# EAGLE design nhb12 (EAGLE 5.08)
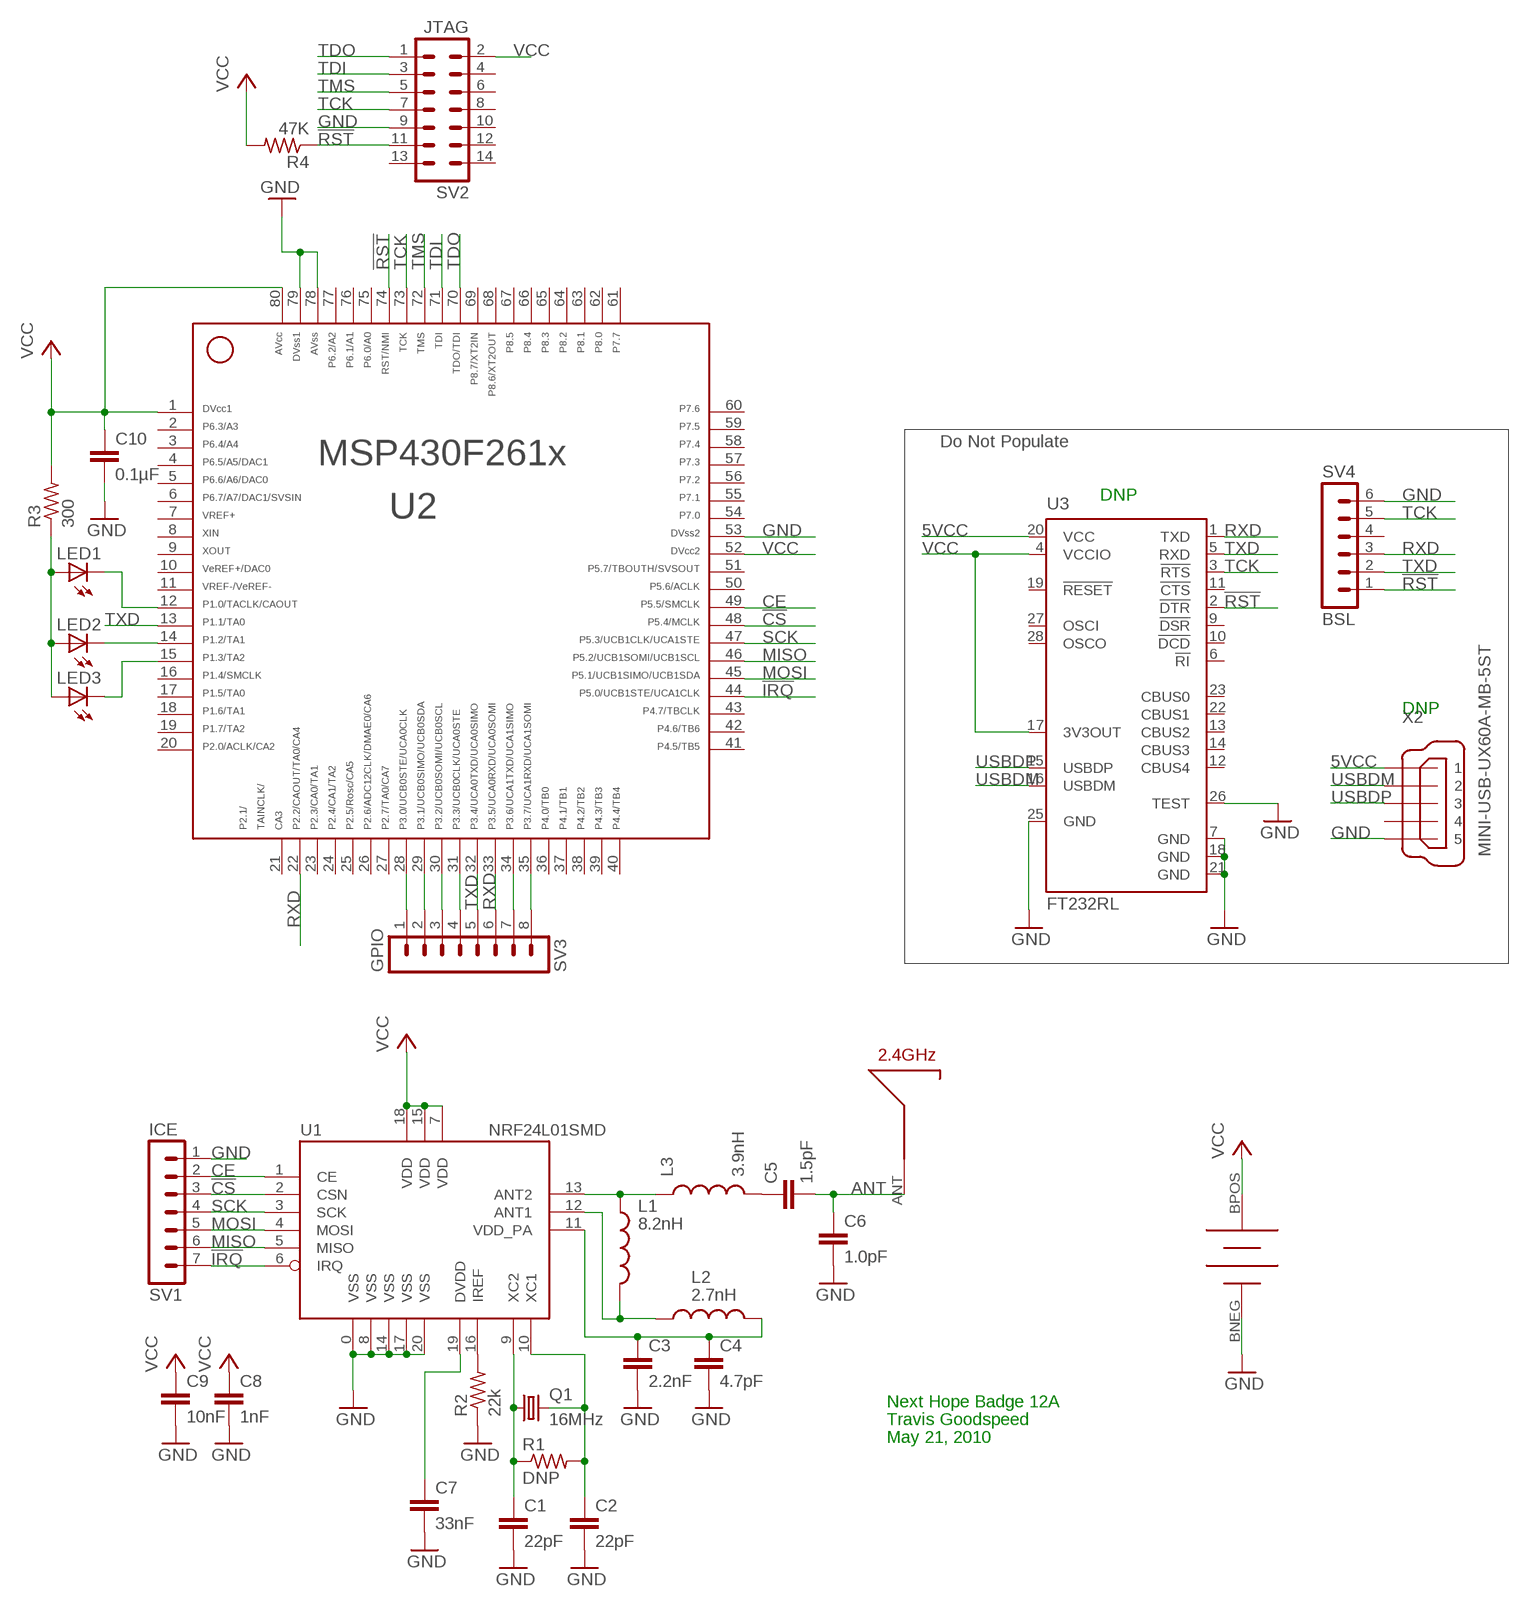
[diagram p0: schematic, sheet 1]

## Parts
C1  22pF  C-EUC0603  [C0603]
C2  22pF  C-EUC0603  [C0603]
C3  2.2nF  C-EUC0603  [C0603]
C4  4.7pF  C-EUC0603  [C0603]
C5  1.5pF  C-EUC0603  [C0603]
C6  1.0pF  C-EUC0603  [C0603]
C7  33nF  C-EUC0603  [C0603]
C8  1nF  C-EUC0603  [C0603]
C9  10nF  C-EUC0603  [C0603]
C10  0.1µF  C-EUC0603  [C0603]
L1  8.2nH  INDUCTOR0603  [0603]
L2  2.7nH  INDUCTOR0603  [0603]
L3  3.9nH  INDUCTOR0603  [0603]
LED1  LEDCHIPLED_0603  [CHIPLED_0603]
LED2  LEDCHIPLED_0603  [CHIPLED_0603]
LED3  LEDCHIPLED_0603  [CHIPLED_0603]
Q1  16MHz  CRYSTALSM49  [SM49]
R1  DNP  R-US_R0603  [R0603]
R2  22k  R-US_R0603  [R0603]
R3  300  R-US_R0603  [R0603]
R4  47K  R-US_R0603  [R0603]
SV1  ICE  MA07-1  [MA07-1]
SV2  JTAG  MA07-2  [MA07-2]
SV3  GPIO  MA08-1  [MA08-1]
SV4  BSL  MA06-1  [MA06-1]
U1  NRF24L01SMD  [QFN20]
U2  F261X---PN80  [PN80]
U3  FT232RL  [SSOP28]
U$1  CR2032  [CR2032]
U$2  ANT24  [ANT24]
X2  MINI-USB-UX60A-MB-5ST  [UX60A-MB-5ST]

## Nets
5VCC: U3.20(VCC) X2.1
!CS: SV1.3 U1.2(CSN) U2.48
!IRQ: SV1.7 U1.6(IRQ) U2.44
!RST: R4.1 SV2.11 SV4.1 U2.74 U3.2(!DTR)
ANT: C5.2 C6.1 U$2.ANT
CE: SV1.2 U1.1(CE) U2.49
GND: C1.2 C2.2 C3.2 C4.2 C6.2 C7.2 C8.2 C9.2 C10.2 R2.1 SV1.1 SV2.9 SV4.6 U1.0(VSS) U1.8(VSS) U1.14(VSS) U1.17(VSS) U1.20(VSS) U2.53 U2.78 U2.79 U3.7(GND) U3.18(GND) U3.21(GND) U3.25(GND) U3.26(TEST) U$1.BNEG(BATGND) X2.5
MISO: SV1.6 U1.5(MISO) U2.46
MOSI: SV1.5 U1.4(MOSI) U2.45
N$1: C1.1 Q1.1 R1.1 U1.9(XC2)
N$2: C2.1 Q1.2 R1.2 U1.10(XC1)
N$3: R2.2 U1.16(IREF)
N$4: C7.1 U1.19(DVDD)
N$5: C3.1 C4.1 L2.2 U1.11(VDD_PA)
N$6: C5.1 L3.2
N$7: L1.2 L2.1 U1.12(ANT1)
N$8: SV3.1 U2.28
N$9: L1.1 L3.1 U1.13(ANT2)
N$10: LED1.A LED2.A LED3.A R3.1
N$11: SV3.2 U2.29
N$12: LED1.C U2.12
N$13: LED3.C U2.15
N$14: LED2.C U2.14
N$15: SV3.3 U2.30
N$16: SV3.4 U2.31
N$19: SV3.7 U2.34
N$23: SV3.8 U2.35
RXD: SV3.6 SV4.3 U2.22 U2.33 U3.1(TXD)
SCK: SV1.4 U1.3(SCK) U2.47
TCK: SV2.7 SV4.5 U2.73 U3.3(!RTS)
TDI: SV2.3 U2.71
TDO: SV2.1 U2.70
TMS: SV2.5 U2.72
TXD: SV3.5 SV4.2 U2.13 U2.32 U3.5(RXD)
USBDM: U3.16(USBDM) X2.2
USBDP: U3.15(USBDP) X2.3
VCC: C8.1 C9.1 C10.1 R3.2 R4.2 SV2.2 U1.7(VDD) U1.15(VDD) U1.18(VDD) U2.1 U2.52 U2.80 U3.4(VCCIO) U3.17(3V3OUT) U$1.BPOS(BATVCC)
Unconnected: SV2.4 SV2.6 SV2.8 SV2.10 SV2.12 SV2.13 SV2.14 SV4.4 U2.2 U2.3 U2.4 U2.5 U2.6 U2.7 U2.8 U2.9 U2.10 U2.11 U2.16 U2.17 U2.18 U2.19 U2.20 U2.21 U2.23 U2.24 U2.25 U2.26 U2.27 U2.36 U2.37 U2.38 U2.39 U2.40 U2.41 U2.42 U2.43 U2.50 U2.51 U2.54 U2.55 U2.56 U2.57 U2.58 U2.59 U2.60 U2.61 U2.62 U2.63 U2.64 U2.65 U2.66 U2.67 U2.68 U2.69 U2.75 U2.76 U2.77 U3.6(!RI) U3.9(!DSR) U3.10(!DCD) U3.11(!CTS) U3.12(CBUS4) U3.13(CBUS2) U3.14(CBUS3) U3.19(!RESET) U3.22(CBUS1) U3.23(CBUS0) U3.27(OSCI) U3.28(OSCO) X2.4

## Notes on the sheet
- Do Not Populate
- DNP
- DNP
- Next Hope Badge 12A
- Travis Goodspeed
- May 21, 2010

## Library data of the parts
C1-C10 = rcl:C-EU: CAPACITOR, European symbol
L1-L3 = SparkFun:INDUCTOR: Inductors Basic Inductor/Choke - 0603 and 1206. Footprints are not proven and vary greatly between part numbers.
LED1-LED3 = led:LED: LED OSRAM: - CHIPLED LG R971, LG N971, LY N971, LG Q971, LY Q971, LO R971, LY R971 LH N974, LH R974 LS Q976, LO Q976, LY Q976 LO Q996 - Hyper CHIPLED LW Q18S LB Q993, LB Q99A, LB R99A - SideLED LS A670, LO A670, LY A670, LG A670, LP A670 LB A673, LV A673, LT A673, LW A673 LH A674 LY A675 LS A676, LA A676, LO A676, LY A676, LW A676 LS A679, LY A679, LG A679 - Hyper Micro SIDELED® LS Y876, LA Y876, LO Y876, LY Y876 LT Y87S - SmartLED LW L88C, LW L88S LB L89C, LB L89S, LG L890 LS L89K, LO L89K, LY L89K LS L896, LA L896, LO L896, LY L896 - TOPLED LS T670, LO T670, LY T670, LG T670, LP T670 LSG T670, LSP T670, LSY T670, LOP T670, LYG T670 LG T671, LOG T671, LSG T671 LB T673, LV T673, LT T673, LW T673 LH T674 LS T676, LA T676, LO T676, LY T676, LB T676, LH T676, LSB T676, LW T676 LB T67C, LV T67C, LT T67C, LS T67K, LO T67K, LY T67K, LW E67C LS E67B, LA E67B, LO E67B, LY E67B, LB E67C, LV E67C, LT E67C LW T67C LS T679, LY T679, LG T679 LS T770, LO T770, LY T770, LG T770, LP T770 LB T773, LV T773, LT T773, LW T773 LH T774 LS E675, LA E675, LY E675, LS T675 LS T776, LA T776, LO T776, LY T776, LB T776 LHGB T686 LT T68C, LB T68C - Hyper Mini TOPLED® LB M676 - Mini TOPLED Santana® LG M470 LS M47K, LO M47K, LY M47K Source: http://www.osram.convergy.de LUXEON: - LUMILED® LXK2-PW12-R00, LXK2-PW12-S00, LXK2-PW14-U00, LXK2-PW14-V00 LXK2-PM12-R00, LXK2-PM12-S00, LXK2-PM14-U00 LXK2-PE12-Q00, LXK2-PE12-R00, LXK2-PE12-S00, LXK2-PE14-T00, LXK2-PE14-U00 LXK2-PB12-K00, LXK2-PB12-L00, LXK2-PB12-M00, LXK2-PB14-N00, LXK2-PB14-P00, LXK2-PB14-Q00 LXK2-PR12-L00, LXK2-PR12-M00, LXK2-PR14-Q00, LXK2-PR14-R00 LXK2-PD12-Q00, LXK2-PD12-R00, LXK2-PD12-S00 LXK2-PH12-R00, LXK2-PH12-S00 LXK2-PL12-P00, LXK2-PL12-Q00, LXK2-PL12-R00 Source: www.luxeon.com KINGBRIGHT: KA-3528ASYC Source: www.kingbright.com
Q1 = crystal:CRYSTAL: CRYSTAL
R1-R4 = rcl:R-US_: RESISTOR, American symbol
SV1 = con-lstb:MA07-1: PIN HEADER
SV2 = con-lstb:MA07-2: PIN HEADER
SV3 = con-lstb:MA08-1: PIN HEADER
SV4 = con-lstb:MA06-1: PIN HEADER
U1 = SparkFun:NRF24L01: 2.4GHz Low Power Transceiver This is the very popular, low cost, very low power RF transceiver from Nordic Semiconductor. Simple SPI interface. SKU: COM-00690
U2 = TI_MSP430_v13:F261X---PN80: ***MSP430F261x***PN80
U3 = ftdichip:FT232R: Source: http://www.ftdichip.com/Documents/DataSheets/DS_FT232R_v104.pdf
U$1 = nhb:CR2032
U$2 = nhb:ANT24: 2.45GHz trace antenna. L=23mm=Lambda_g/4 Lambda_0=122mm Lambda_g=0.75*Lambda_0
X2 = con-hirose:MINI-USB-: MINI USB Connector Source: http://www.hirose.co.jp/cataloge_hp/e24000019.pdf

## Board
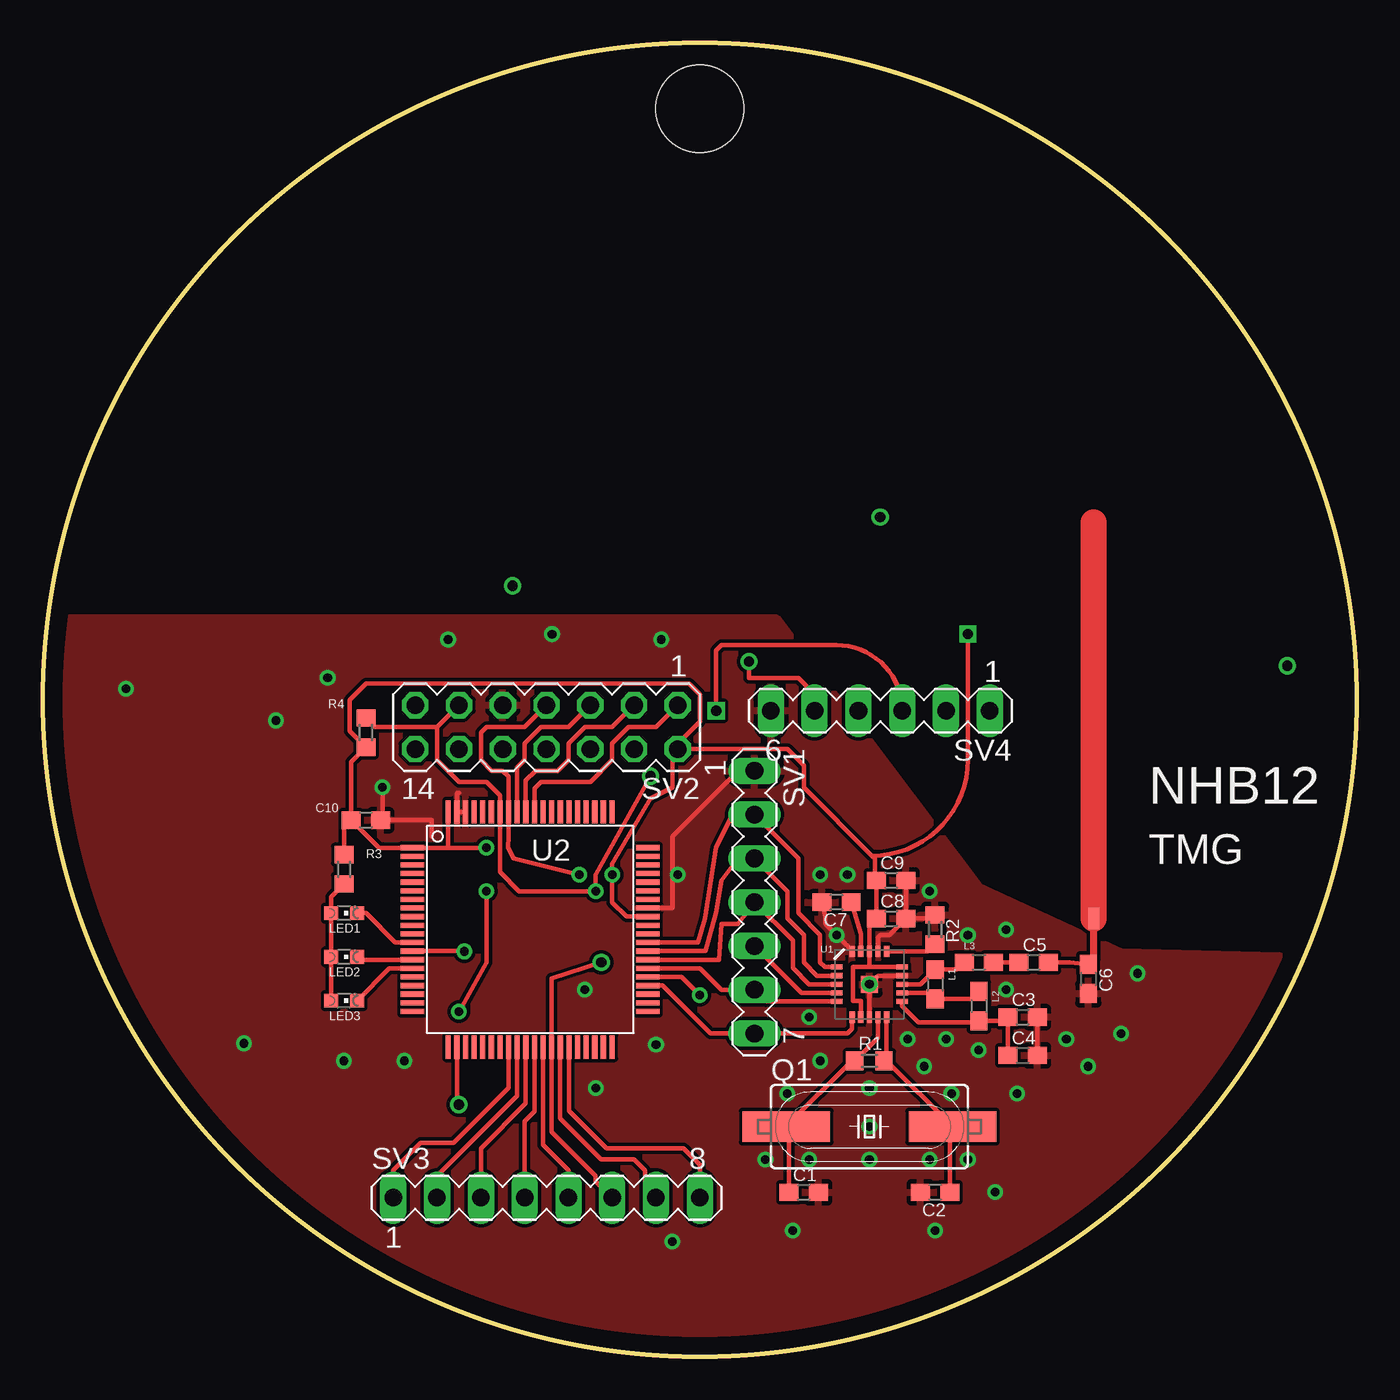
[diagram p1: board, top side]
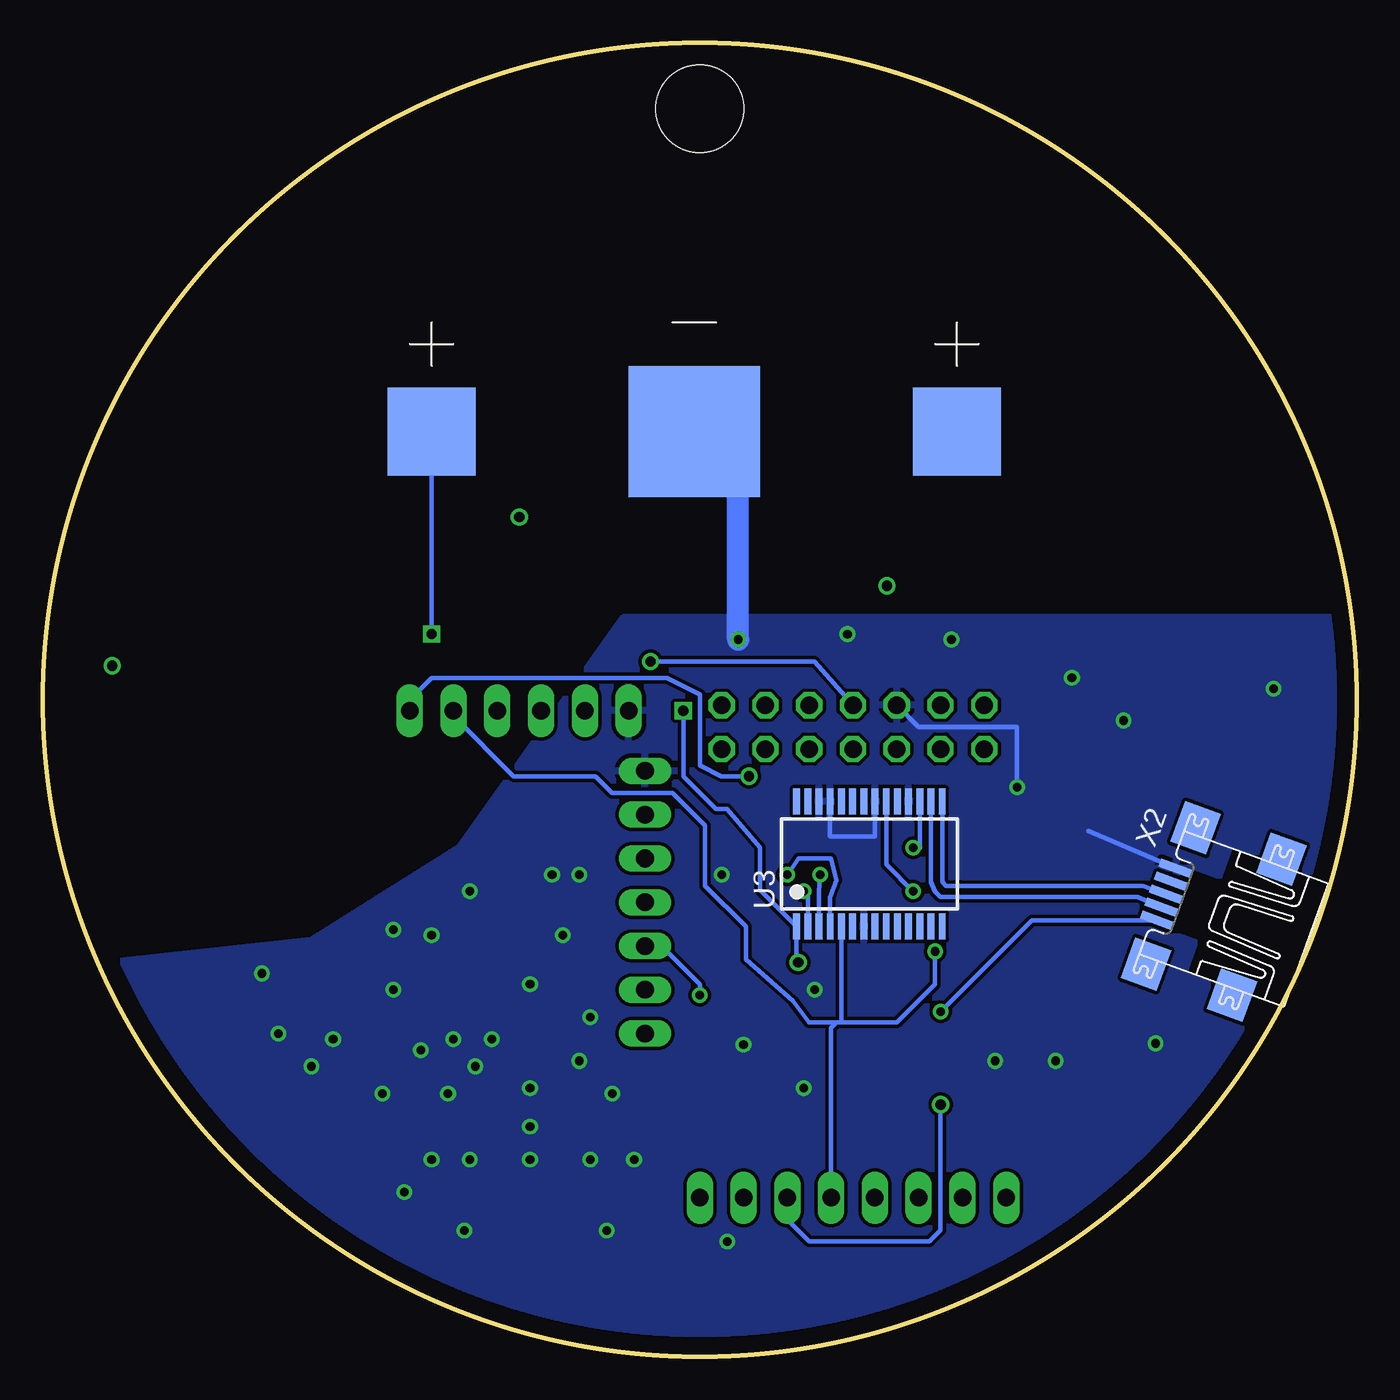
[diagram p2: board, bottom side, seen from below]

Size 76.2 x 76.2 mm. Coordinates in mm from the lower left corner, seen from the top.
Outline: circle at 38.1,38.1 radius 38.1
Copper layers (1*16): Top 0.035mm / dielectric 1.5mm / Bottom 0.035mm
Design rules "default *": minimum track width 10mil, minimum drill 8mil, track to track 8mil, track to pad 8mil, pad to pad 4mil, via to via 8mil, smd to smd 4mil, copper to edge 40mil, drill to drill 4mil, minimum pad ring 10mil, minimum via ring 8mil, stop-mask expansion 4mil, vias tented up to drill 0mil, thermal gap 10mil
Holes 5.08 mm at 38.1,72.39

### Footprints (pad centres in the part's own frame; a part is rotated, then mirrored left to right if it is on the bottom)
C0603 = smd 1.1 x 1: 1 -0.85,0; 2 0.85,0
0603 = smd 1.1 x 1: 1 -0.85,0; 2 0.85,0
CHIPLED_0603 = smd 0.8 x 0.8: A 0,-0.75; C 0,0.75
SM49 = smd 5.08 x 1.778: 1 -4.826,0; 2 4.826,0
R0603 = smd 1 x 1.1: 1 -0.85,0; 2 0.85,0
MA07-1 = drill 1.016 long: 1 -7.62,0; 2 -5.08,0; 3 -2.54,0; 4 0,0; 5 2.54,0; 6 5.08,0; 7 7.62,0
MA07-2 = drill 1.016 octagon: 1 -7.62,-1.27; 2 -7.62,1.27; 3 -5.08,-1.27; 4 -5.08,1.27; 5 -2.54,-1.27; 6 -2.54,1.27; 7 0,-1.27; 8 0,1.27; 9 2.54,-1.27; 10 2.54,1.27; 11 5.08,-1.27; 12 5.08,1.27; 13 7.62,-1.27; 14 7.62,1.27
MA08-1 = drill 1.016 long: 1 -8.89,0; 2 -6.35,0; 3 -3.81,0; 4 -1.27,0; 5 1.27,0; 6 3.81,0; 7 6.35,0; 8 8.89,0
MA06-1 = drill 1.016 long: 1 -6.35,0; 2 -3.81,0; 3 -1.27,0; 4 1.27,0; 5 3.81,0; 6 6.35,0
QFN20 = smd 1 x 1: 0 0,0 | smd 0.65 x 0.3: 1 -1.9,1; 2 -1.9,0.5; 3 -1.9,0; 4 -1.9,-0.5; 5 -1.9,-1; 11 1.9,-1; 12 1.9,-0.5; 13 1.9,0; 14 1.9,0.5; 15 1.9,1 | smd 0.3 x 0.65: 6 -1,-1.9; 7 -0.5,-1.9; 8 0,-1.9; 9 0.5,-1.9; 10 1,-1.9; 16 1,1.9; 17 0.5,1.9; 18 0,1.9; 19 -0.5,1.9; 20 -1,1.9
PN80 = smd 1.35 x 0.3: 1 -6.825,4.75; 2 -6.825,4.25; 3 -6.825,3.75; 4 -6.825,3.25; 5 -6.825,2.75; 6 -6.825,2.25; 7 -6.825,1.75; 8 -6.825,1.25; 9 -6.825,0.75; 10 -6.825,0.25; 11 -6.825,-0.25; 12 -6.825,-0.75; 13 -6.825,-1.25; 14 -6.825,-1.75; 15 -6.825,-2.25; 16 -6.825,-2.75; 17 -6.825,-3.25; 18 -6.825,-3.75; 19 -6.825,-4.25; 20 -6.825,-4.75; 41 6.825,-4.75; 42 6.825,-4.25; 43 6.825,-3.75; 44 6.825,-3.25; 45 6.825,-2.75; 46 6.825,-2.25; 47 6.825,-1.75; 48 6.825,-1.25; 49 6.825,-0.75; 50 6.825,-0.25; 51 6.825,0.25; 52 6.825,0.75; 53 6.825,1.25; 54 6.825,1.75; 55 6.825,2.25; 56 6.825,2.75; 57 6.825,3.25; 58 6.825,3.75; 59 6.825,4.25; 60 6.825,4.75 | smd 0.3 x 1.35: 21 -4.75,-6.825; 22 -4.25,-6.825; 23 -3.75,-6.825; 24 -3.25,-6.825; 25 -2.75,-6.825; 26 -2.25,-6.825; 27 -1.75,-6.825; 28 -1.25,-6.825; 29 -0.75,-6.825; 30 -0.25,-6.825; 31 0.25,-6.825; 32 0.75,-6.825; 33 1.25,-6.825; 34 1.75,-6.825; 35 2.25,-6.825; 36 2.75,-6.825; 37 3.25,-6.825; 38 3.75,-6.825; 39 4.25,-6.825; 40 4.75,-6.825; 61 4.75,6.825; 62 4.25,6.825; 63 3.75,6.825; 64 3.25,6.825; 65 2.75,6.825; 66 2.25,6.825; 67 1.75,6.825; 68 1.25,6.825; 69 0.75,6.825; 70 0.25,6.825; 71 -0.25,6.825; 72 -0.75,6.825; 73 -1.25,6.825; 74 -1.75,6.825; 75 -2.25,6.825; 76 -2.75,6.825; 77 -3.25,6.825; 78 -3.75,6.825; 79 -4.25,6.825; 80 -4.75,6.825
SSOP28 = smd 0.4 x 1.5: 1 -4.225,-3.625; 2 -3.575,-3.625; 3 -2.925,-3.625; 4 -2.275,-3.625; 5 -1.625,-3.625; 6 -0.975,-3.625; 7 -0.325,-3.625; 8 0.325,-3.625; 9 0.975,-3.625; 10 1.625,-3.625; 11 2.275,-3.625; 12 2.925,-3.625; 13 3.575,-3.625; 14 4.225,-3.625; 15 4.225,3.625; 16 3.575,3.625; 17 2.925,3.625; 18 2.275,3.625; 19 1.625,3.625; 20 0.975,3.625; 21 0.325,3.625; 22 -0.325,3.625; 23 -0.975,3.625; 24 -1.625,3.625; 25 -2.275,3.625; 26 -2.925,3.625; 27 -3.575,3.625; 28 -4.225,3.625
CR2032 = smd 7.62 x 7.62: BNEG 0,0 | smd 5.08 x 5.08: BPOS -15.24,0; BPOS2 15.24,0
ANT24 = smd 0.635 x 1.27: ANT 0,0
UX60A-MB-5ST = smd 2 x 0.5: 1 2.25,1.6; 2 2.25,0.8; 3 2.25,0; 4 2.25,-0.8; 5 2.25,-1.6 | smd 2.2 x 2.5: M1 -3.3,-4.2; M2 -3.3,4.2; M3 2,4.2; M4 2,-4.2

### Placement (x,y rotation side)
C1  44.13,9.53 0 top
C2  51.75,9.53 180 top
C3  56.83,19.69 0 top
C4  56.83,17.46 0 top
C5  57.47,22.86 0 top
C6  60.64,21.91 270 top
C7  46.04,26.35 180 top
C8  49.21,25.4 0 top
C9  49.21,27.62 0 top
C10  18.73,31.12 0 top
L1  51.75,21.59 270 top
L2  54.29,20.32 270 top
L3  54.29,22.86 0 top
LED1  17.46,25.72 270 top
LED2  17.46,23.18 270 top
LED3  17.46,20.64 270 top
Q1  47.94,13.34 0 top
R1  47.94,17.15 0 top
R2  51.75,24.77 270 top
R3  17.46,28.26 90 top
R4  18.73,36.2 270 top
SV1  41.28,26.35 270 top
SV2  29.21,36.51 180 top
SV3  29.21,9.21 0 top
SV4  48.58,37.47 180 top
U1  47.94,21.59 0 top
U2  28.26,24.77 0 top
U3  28.26,28.58 0 bottom
U$1  38.42,53.66 0 bottom
U$2  60.96,25.4 0 top
X2  8.89,26.04 160 bottom

### Tracks (layer width: path | path; a pad name or v marks a point on that pad's centre or on a via)
5VCC  (via drill 0.5 pad 0.25)
  Top 0.254: v25.72,26.99 25.72,22.86 v24.13,20
  Bottom 0.254: U3.20 27.28,28.55 v25.72,26.99 | v24.13,20 18.83,25.3 X2.1
!CS
  Top 0.254: U1.2 44.9,22.09 44.13,22.86 44.13,24.45 43.18,25.4 43.18,26.99 SV1.3 40.32,28.89 39.37,27.62 39.05,25.72 38.44,23.52 U2.48
!IRQ
  Top 0.254: U1.6 46.94,19 46.67,18.73 SV1.7 38.73,18.73 35.95,21.52 U2.44
!RST  (via drill 0.5 pad 0.25, 0.6)
  Top 0.254: 22.86,36.51 22.86,34.61 24.13,33.34 25.72,33.34 26.51,32.55 U2.74 26.51,28.1 27.62,26.99 v32.07,26.99 32.07,27.94 v35.24,33.66 | 22.86,36.51 SV2.11 | 22.86,36.51 19.26,36.51 R4.1
  Bottom 0.254: U3.2 31.83,26.75 v32.07,26.99 | v35.24,33.66 36.83,33.66 38.1,34.29 38.1,38.42 40,39.37 53.66,39.37 54.93,38.1 SV4.1
ANT
  Top 0.254: C5.2 59.59,22.86 C6.1
  Top 0.406: U$2.ANT 60.96,23.08 C6.1
CE
  Top 0.254: U1.1 45.35,22.59 45.08,22.86 45.08,24.45 43.81,25.72 43.81,28.89 SV1.2 40,31.43 39.05,29.53 38.42,25.4 37.98,24.02 U2.49
GND  (via drill 0.5, 0.5 pad 0.25)
  Top 0.254: U1.14 48.44,22.09 U1.0 U1.8 | C8.2 C9.2 | U1.17 48.44,24.31 48.58,24.45 49.11,24.45 C8.2 | C8.2 51.54,25.4 R2.1 | C4.2 C3.2 | U1.20 46.94,23.54 v46.04,24.45 45.4,25.08 45.4,25.5 C7.2 | U2.78 U2.79 24.01,32.7 24.13,32.7 | U2.53 36.49,26.02 36.51,26.04 36.51,30.16 40.32,33.97 SV1.1 | v19.68,33.02 19.68,31.22 C10.2 22.54,31.12 22.54,30.16
  Bottom 0.254: SV2.9 25.4,36.51 19.68,36.51 v19.68,33.02 | X2.5 15.56,30.48 | U3.21 27.93,30.16 30.53,30.16 U3.25
  Bottom 0.406: 35.88,53.66 U$1.BNEG
  Bottom 1.27: v35.88,41.59 35.88,53.66
  other vias: 47.94,21.59 53.66,24.45 45.09,27.94 46.67,27.94 51.44,26.99 55.88,24.77 55.88,21.27 44.45,19.69 50.16,18.42 52.39,18.42 54.29,17.78 51.12,16.83 41.91,11.43 43.18,15.24 45.09,17.15 47.94,15.56 47.94,13.34 44.45,11.43 47.94,11.43 51.44,11.43 53.66,11.43 52.71,15.24 36.51,6.67 4.8,38.74 43.5,7.3 29.53,41.91 51.75,7.3 13.5,36.89 55.25,9.53 11.64,18.16 63.5,22.23 60.64,16.83 62.55,18.73 59.37,18.42 56.52,15.24 23.5,41.59 32.07,15.56 35.56,18.1 20.96,17.15 17.46,17.15 16.51,39.37 31.43,21.27 36.83,27.94
  pour Bottom: -0.95,42.86 42.55,42.86 52.07,29.53 60.64,24.13 75.25,22.54 75.25,-0.32 -0.95,-0.32
  pour Top: -0.95,42.86 42.55,42.86 54.29,27.31 62.55,23.5 75.25,23.18 75.25,-0.63 -0.95,-0.63
MISO
  Top 0.254: U1.5 41.96,20.59 SV1.6 39.37,21.27 38.13,22.52 U2.46
MOSI  (via drill 0.5 pad 0.25)
  Top 0.254: U1.4 44,21.09 SV1.5 | U2.45 37.04,22.02 v38.1,20.96
  Bottom 0.254: v38.1,20.96 38.1,21.59 40.32,23.81 SV1.5
N$1
  Top 0.254: U1.9 48.44,18.5 R1.1 46.93,17.15 Q1.1 43.28,13.17 C1.1
N$2
  Top 0.254: 48.94,17.3 U1.10 | 48.94,17.3 R1.2 | 48.94,17.3 48.94,17.16 Q1.2 52.6,13.17 C2.1
N$3
  Top 0.254: U1.16 51.33,23.49 R2.2
N$4
  Top 0.254: U1.19 47.44,24.53 C7.1
N$5
  Top 0.254: U1.11 49.84,20.33 50.8,19.37 54.19,19.37 L2.2 55.77,19.47 C3.1 C4.1
N$6
  Top 0.254: C5.1 L3.2
N$7
  Top 0.254: U1.12 51.4,21.09 L1.2 53.86,20.74 L2.1
N$8
  Top 0.254: U2.28 27.01,15.58 23.81,12.38 21.91,12.38 20.32,10.8 SV3.1
N$9
  Top 0.254: U1.13 50.9,21.59 L1.1 53.02,22.44 L3.1
N$10
  Top 0.254: R3.1 16.71,26.66 LED1.A LED2.A LED3.A
N$11
  Top 0.254: U2.29 27.51,15.13 22.86,10.48 SV3.2
N$12
  Top 0.254: U2.12 20.43,24.02 18.73,25.72 LED1.C
N$13
  Top 0.254: U2.15 20.09,22.52 LED3.C
N$14
  Top 0.254: U2.14 18.37,23.02 LED2.C
N$15
  Top 0.254: U2.30 28.01,14.67 25.4,12.07 SV3.3
N$16
  Top 0.254: U2.31 28.51,14.22 27.94,13.65 SV3.4
N$17  (via drill 0.6)
  other vias: 27.24,44.72
N$18  (via drill 0.6)
  other vias: 48.57,48.7
N$19
  Top 0.254: U2.34 30.01,13.81 32.38,11.43 34.29,11.43 34.92,10.8 34.92,9.84 SV3.7
N$20  (via drill 0.6)
  other vias: 72.19,40.06
N$23
  Top 0.254: U2.35 30.51,14.26 32.7,12.07 37.15,12.07 38.1,11.11 SV3.8
RXD  (via drill 0.6)
  Top 0.254: SV3.6 32.07,10.16 32.07,10.48 29.51,13.04 U2.33 29.51,21.93 v32.38,22.86 | U2.22 24.01,14.61 v24.13,14.61 | v39.05,37.47 39.05,40.96 39.37,41.28 46.04,41.28 arc-90 SV4.3
  Bottom 0.254: v24.13,14.61 24.13,7.3 24.76,6.67 31.75,6.67 33.02,7.94 SV3.6 | v39.05,37.47 39.05,33.66 37.15,31.75 36.51,31.75 34.61,29.53 34.61,27.08 U3.1 32.48,23.28 v32.38,22.86
SCK
  Top 0.254: U1.3 44.45,21.59 43.5,22.54 43.5,24.13 SV1.4 40.32,25.08 39.37,25.08 39.21,23.02 U2.47
TCK  (via drill 0.5 pad 0.25, 0.6)
  Top 0.254: SV2.7 27.94,36.51 25.72,36.51 25.4,36.2 25.4,34.61 26.03,33.97 26.67,33.97 27.01,33.64 U2.73 27.01,30.18 26.99,29.53 27.3,28.89 v31.11,27.94 | SV4.5 44.77,38.42 43.81,39.37 40.96,39.37 v40.96,40.32
  Bottom 0.254: U3.3 31.18,26.92 v31.11,27.94 | v40.96,40.32 31.43,40.32 SV2.7
TDI
  Top 0.254: U2.71 28.01,33.41 28.57,33.97 29.84,33.97 30.48,34.61 30.48,35.56 31.43,36.51 33.02,36.51 SV2.3
TDO
  Top 0.254: U2.70 28.51,32.95 28.89,33.34 31.75,33.34 33.02,34.61 33.02,35.56 33.97,36.51 35.56,36.51 SV2.1
TMS
  Top 0.254: U2.72 27.51,34.18 27.94,34.61 27.94,35.56 28.89,36.51 30.48,36.51 SV2.5
TXD  (via drill 0.5 pad 0.25)
  Top 0.254: U2.13 24.43,23.52 v24.45,23.5 | U2.32 29.01,12.27 30.48,10.8 SV3.5
  Bottom 0.254: v24.45,23.5 24.45,21.59 26.67,19.37 29.84,19.37 | 30.16,19.37 31.75,19.37 32.7,20.64 35.43,23.05 35.43,24.95 37.78,27.31 37.78,30.8 39.69,32.7 43.18,32.7 44.13,33.66 48.89,33.66 52.39,37.15 SV4.2 | 30.16,19.37 29.84,19.37 | 30.16,19.37 30.48,19.05 SV3.5 | U3.5 29.88,19.41 29.84,19.37
USBDM
  Bottom 0.254: U3.16 24.68,27.54 24.45,26.99 24.13,26.67 12.7,26.67 X2.2
USBDP
  Bottom 0.254: U3.15 24.03,27.53 23.81,27.31 12.38,27.31 X2.3
VCC  (via drill 0.5 pad 0.25, 0.6)
  Top 0.254: 47.94,22.59 46.99,22.59 46.99,20.64 47.44,20.64 U1.7 | 47.94,22.59 U1.15 | 47.94,22.59 U1.18 47.94,24.98 C8.1 C9.1 48.26,27.73 48.26,28.89 48.1,29.05 | R3.2 17.46,30.7 C10.1 | C10.1 19.48,29.52 U2.1 23.51,29.52 | U2.52 33.86,25.52 33.02,26.35 v33.02,27.94 33.02,28.58 35.24,32.39 36.51,33.02 36.51,34.93 SV2.2 | 23.51,29.52 v25.72,29.52 | SV2.2 43.18,35.24 44.13,34.29 44.13,33.02 48.1,29.05 | C10.1 17.88,34.5 R4.2 17.78,36.3 17.78,38.1 18.73,39.05 37.46,39.05 38.1,38.42 38.1,36.83 36.83,35.56 SV2.2 | v53.66,41.91 53.66,34.61 arc-90 48.1,29.05 | 23.51,29.52 U2.80
  Bottom 0.254: U3.17 25.33,29.52 v25.72,29.52 | v33.02,27.94 32.38,28.89 30.48,28.89 30.16,27.62 30.53,26.62 U3.4 | v53.66,41.91 U$1.BPOS

### Text on the board
tNames: NHB12 | TMG
202bmp: /Users/travis/front.bmp
222bmp: /Users/travis/back_1.bmp